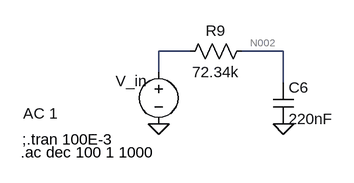
[diagram p0: schematic Experiment_1_b_A.asc]
Experiment_1_b_A.asc, the LTspice schematic file:
Version 4
SHEET 1 880 680
WIRE 144 96 96 96
WIRE 288 96 224 96
WIRE 96 128 96 96
WIRE 288 144 288 96
FLAG 96 208 0
FLAG 288 208 0
SYMBOL voltage 96 112 R0
WINDOW 0 -66 30 Left 2
WINDOW 3 -208 80 Left 2
WINDOW 123 0 0 Left 0
WINDOW 39 0 0 Left 0
SYMATTR InstName V_in
SYMATTR Value AC 1
SYMBOL cap 272 144 R0
SYMATTR InstName C6
SYMATTR Value 220nF
SYMBOL res 240 80 R90
WINDOW 0 0 56 VBottom 2
WINDOW 3 32 56 VTop 2
SYMATTR InstName R9
SYMATTR Value 72.34k
TEXT -114 232 Left 2 !;.tran 100E-3
TEXT -116 252 Left 2 !.ac dec 100 1 1000

The netlist it stands for:
* Experiment_1_b_A.asc
V_in N001 0 AC 1
C6 N002 0 220nF
R9 N002 N001 72.34k
;.tran 100E-3
.ac dec 100 1 1000
.backanno
.end

* Results of the author's LTspice run, read from the files saved beside the schematic
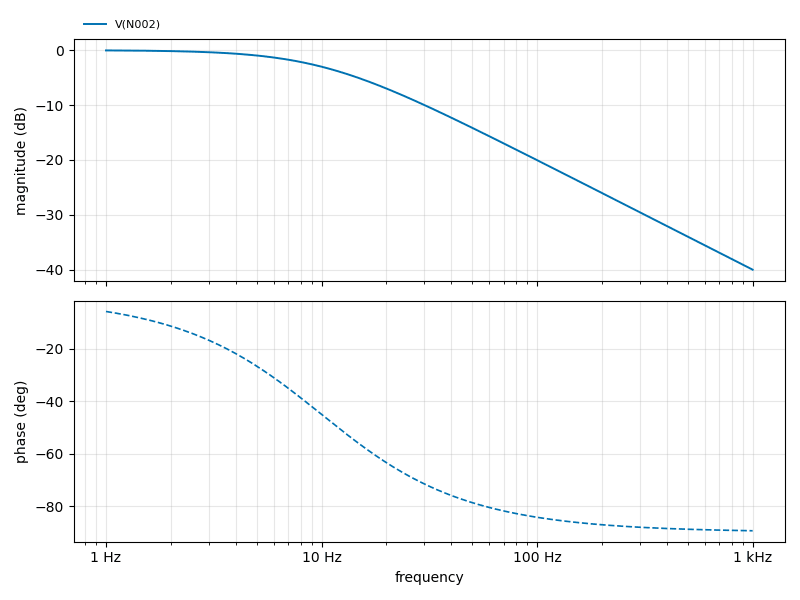
[diagram p1: AC Analysis of Experiment_1_b_A.asc, plotted from the saved traces]
* AC Analysis, 1 run:
*   V(N002): -0.04 dB at 1 Hz, -40.00 dB at 1 kHz, peak -0.04 dB at 1 Hz, 3 dB below the peak at 10.1 Hz